# Altium schematic sheet 00_Cover.SchDoc
size A4
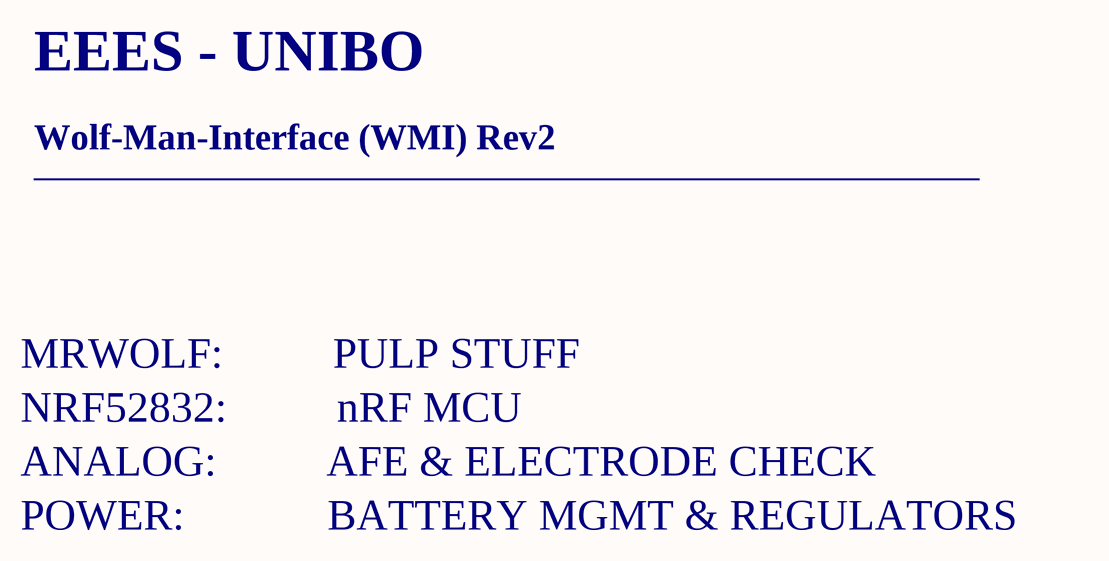
[diagram p0: 00_Cover.SchDoc]

## Notes on the sheet
- EEES - UNIBO
- Wolf-Man-Interface (WMI) Rev2
- ___________________________________________
- MRWOLF:          PULP STUFF
- NRF52832:          nRF MCU
- ANALOG:          AFE & ELECTRODE CHECK
- POWER:             BATTERY MGMT & REGULATORS